# EAGLE design vending-machine-v2-arduino-shield-r2 (EAGLE 5.11)
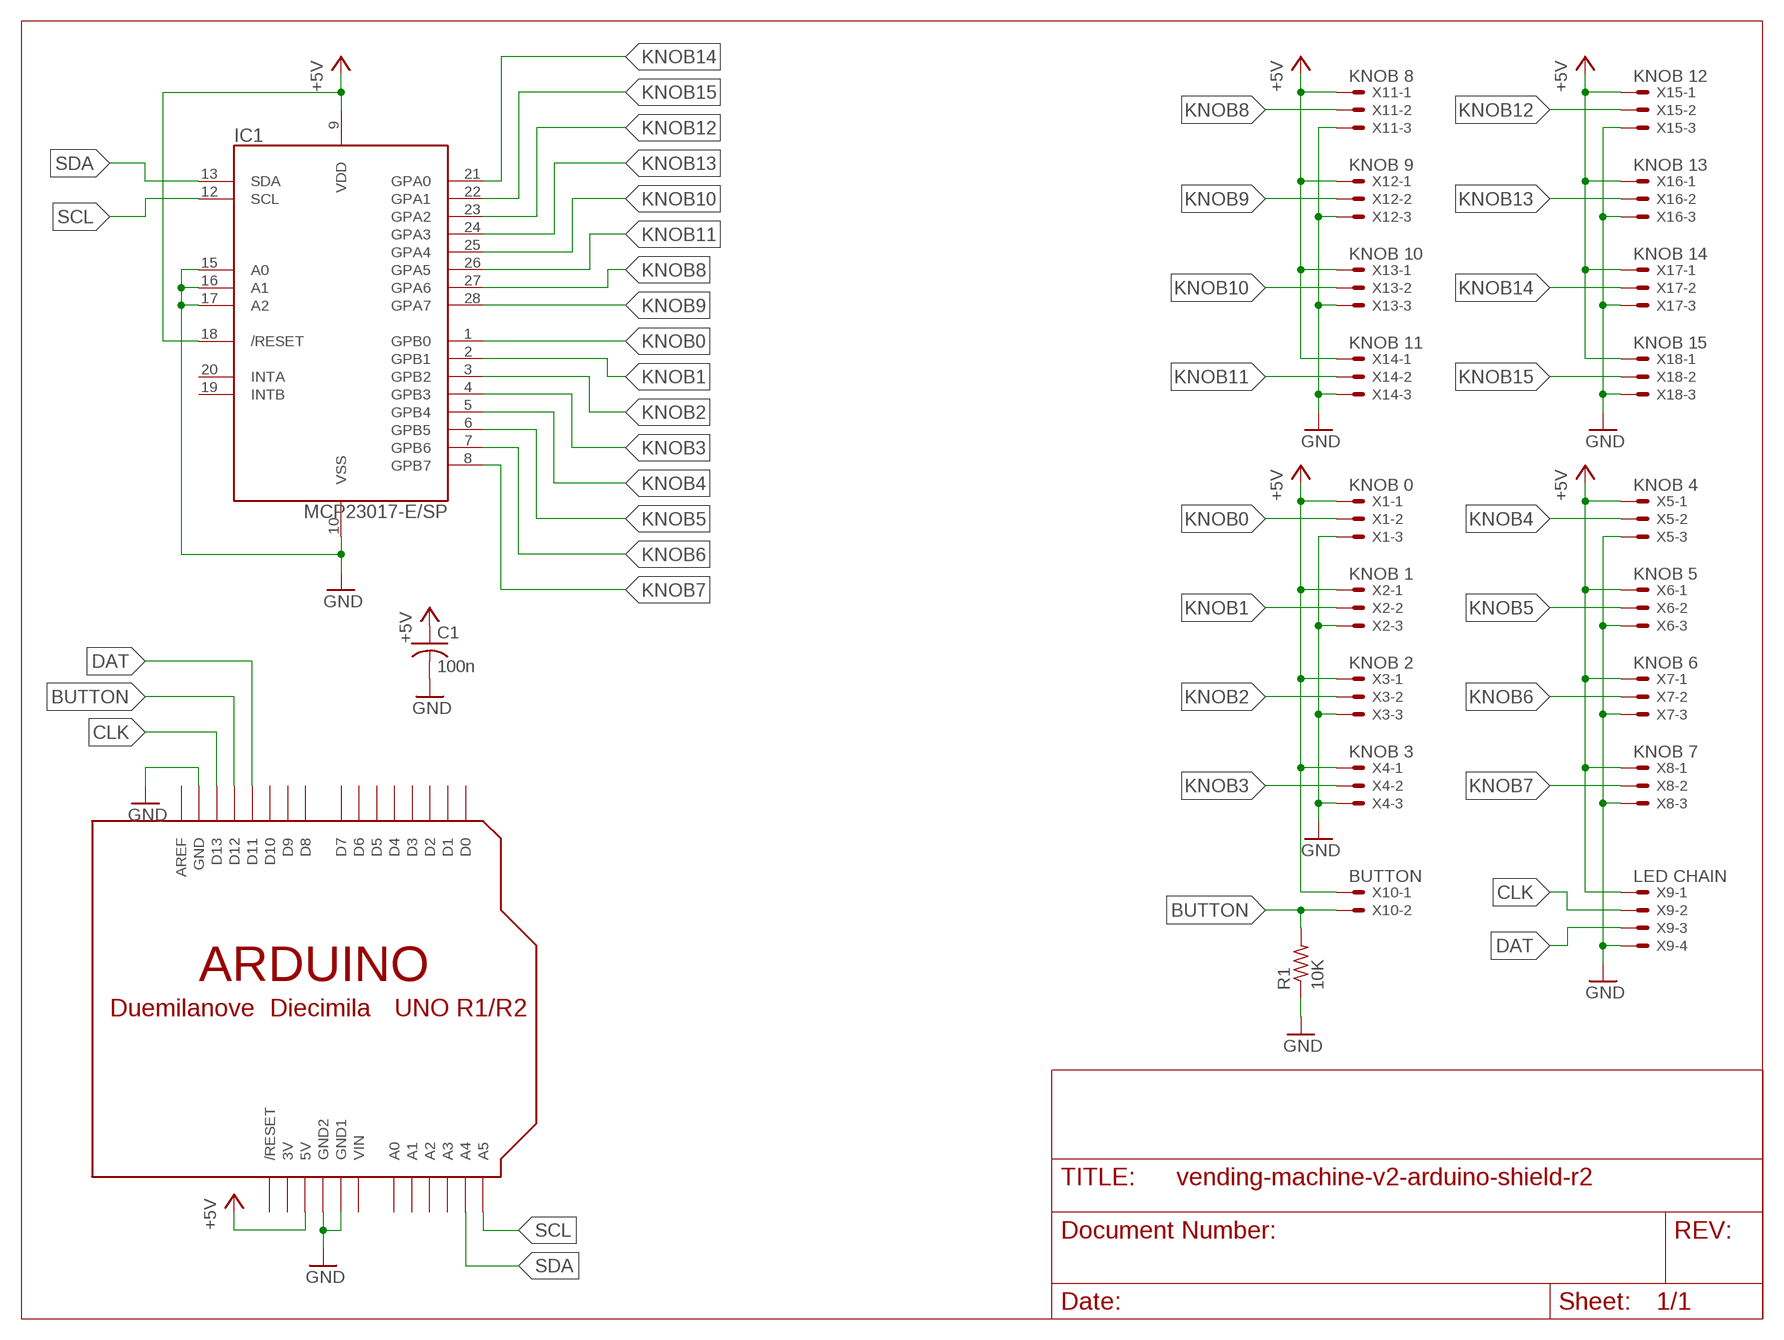
[diagram p0: schematic, sheet 1]

## Parts
C1  100n  C-US025-025X050  [C025-025X050]
IC1  MCP23017-E/SP  [DIP-28S]
R1  10K  R-US_0204/2V  [0204V]
U$1  ARDUINOUNO  [ARDUINO]
X1  KNOB 0  22-23-2031  [22-23-2031]
X2  KNOB 1  22-23-2031  [22-23-2031]
X3  KNOB 2  22-23-2031  [22-23-2031]
X4  KNOB 3  22-23-2031  [22-23-2031]
X5  KNOB 4  22-23-2031  [22-23-2031]
X6  KNOB 5  22-23-2031  [22-23-2031]
X7  KNOB 6  22-23-2031  [22-23-2031]
X8  KNOB 7  22-23-2031  [22-23-2031]
X9  LED CHAIN  22-23-2041  [22-23-2041]
X10  BUTTON  22-23-2021  [22-23-2021]
X11  KNOB 8  22-23-2031  [22-23-2031]
X12  KNOB 9  22-23-2031  [22-23-2031]
X13  KNOB 10  22-23-2031  [22-23-2031]
X14  KNOB 11  22-23-2031  [22-23-2031]
X15  KNOB 12  22-23-2031  [22-23-2031]
X16  KNOB 13  22-23-2031  [22-23-2031]
X17  KNOB 14  22-23-2031  [22-23-2031]
X18  KNOB 15  22-23-2031  [22-23-2031]

## Nets
+5V: C1.1 IC1.9(VDD) IC1.18(/RESET) U$1.5V X1.1 X2.1 X3.1 X4.1 X5.1 X6.1 X7.1 X8.1 X9.1 X10.1 X11.1 X12.1 X13.1 X14.1 X15.1 X16.1 X17.1 X18.1
BUTTON: R1.2 U$1.D12 X10.2
CLK: U$1.D13 X9.2
DAT: U$1.D11 X9.3
GND: C1.2 IC1.10(VSS) IC1.15(A0) IC1.16(A1) IC1.17(A2) R1.1 U$1.GND U$1.GND1 U$1.GND2 X1.3 X2.3 X3.3 X4.3 X5.3 X6.3 X7.3 X8.3 X9.4 X11.3 X12.3 X13.3 X14.3 X15.3 X16.3 X17.3 X18.3
KNOB0: IC1.1(GPB0) X1.2
KNOB1: IC1.2(GPB1) X2.2
KNOB2: IC1.3(GPB2) X3.2
KNOB3: IC1.4(GPB3) X4.2
KNOB4: IC1.5(GPB4) X5.2
KNOB5: IC1.6(GPB5) X6.2
KNOB6: IC1.7(GPB6) X7.2
KNOB7: IC1.8(GPB7) X8.2
KNOB8: IC1.27(GPA6) X11.2
KNOB9: IC1.28(GPA7) X12.2
KNOB10: IC1.25(GPA4) X13.2
KNOB11: IC1.26(GPA5) X14.2
KNOB12: IC1.23(GPA2) X15.2
KNOB13: IC1.24(GPA3) X16.2
KNOB14: IC1.21(GPA0) X17.2
KNOB15: IC1.22(GPA1) X18.2
SCL: IC1.12(SCL) U$1.A5
SDA: IC1.13(SDA) U$1.A4
Unconnected: IC1.19(INTB) IC1.20(INTA) U$1.A0 U$1.A1 U$1.A2 U$1.A3 U$1.AREF U$1.D0 U$1.D1 U$1.D2 U$1.D3 U$1.D4 U$1.D5 U$1.D6 U$1.D7 U$1.D8 U$1.D9 U$1.D10 U$1.RESET(/RESET)

## Power pins joined to a net without a drawn wire
3V: U$1.3V
VIN: U$1.VIN

## Library data of the parts
C1 = rcl:C-US: CAPACITOR, American symbol
IC1 = rbg-microchip-ioexpander:MCP23017
R1 = rcl:R-US_: RESISTOR, American symbol
U$1 = adafruit:ARDUINO: Arduino Diecimila/Duemilanove Make a shield with ease, this package has all the named pins as well as the two mounting drill holes and an outline of the USB and DC power connector. The outline is on the DIMENSION layer, so if your board house uses it they will cut the outline to match. http://www.ladyada.net/library/pcb/eaglelibrary.html
X1-X8 X11-X18 = con-molex:22-23-2031: .100" (2.54mm) Center Header - 3 Pin; MF: MOLEX; MPN: 22-23-2031; OC_FARNELL: 1462950; OC_NEWARK: 30C0862
X9 = con-molex:22-23-2041: .100" (2.54mm) Center Header - 4 Pin; MF: MOLEX; MPN: 22-23-2041; OC_FARNELL: 1462920; OC_NEWARK: 38C0355
X10 = con-molex:22-23-2021: .100" (2.54mm) Center Header - 2 Pin; MF: MOLEX; MPN: 22-23-2021; OC_FARNELL: 1462926; OC_NEWARK: 25C3832

## Board
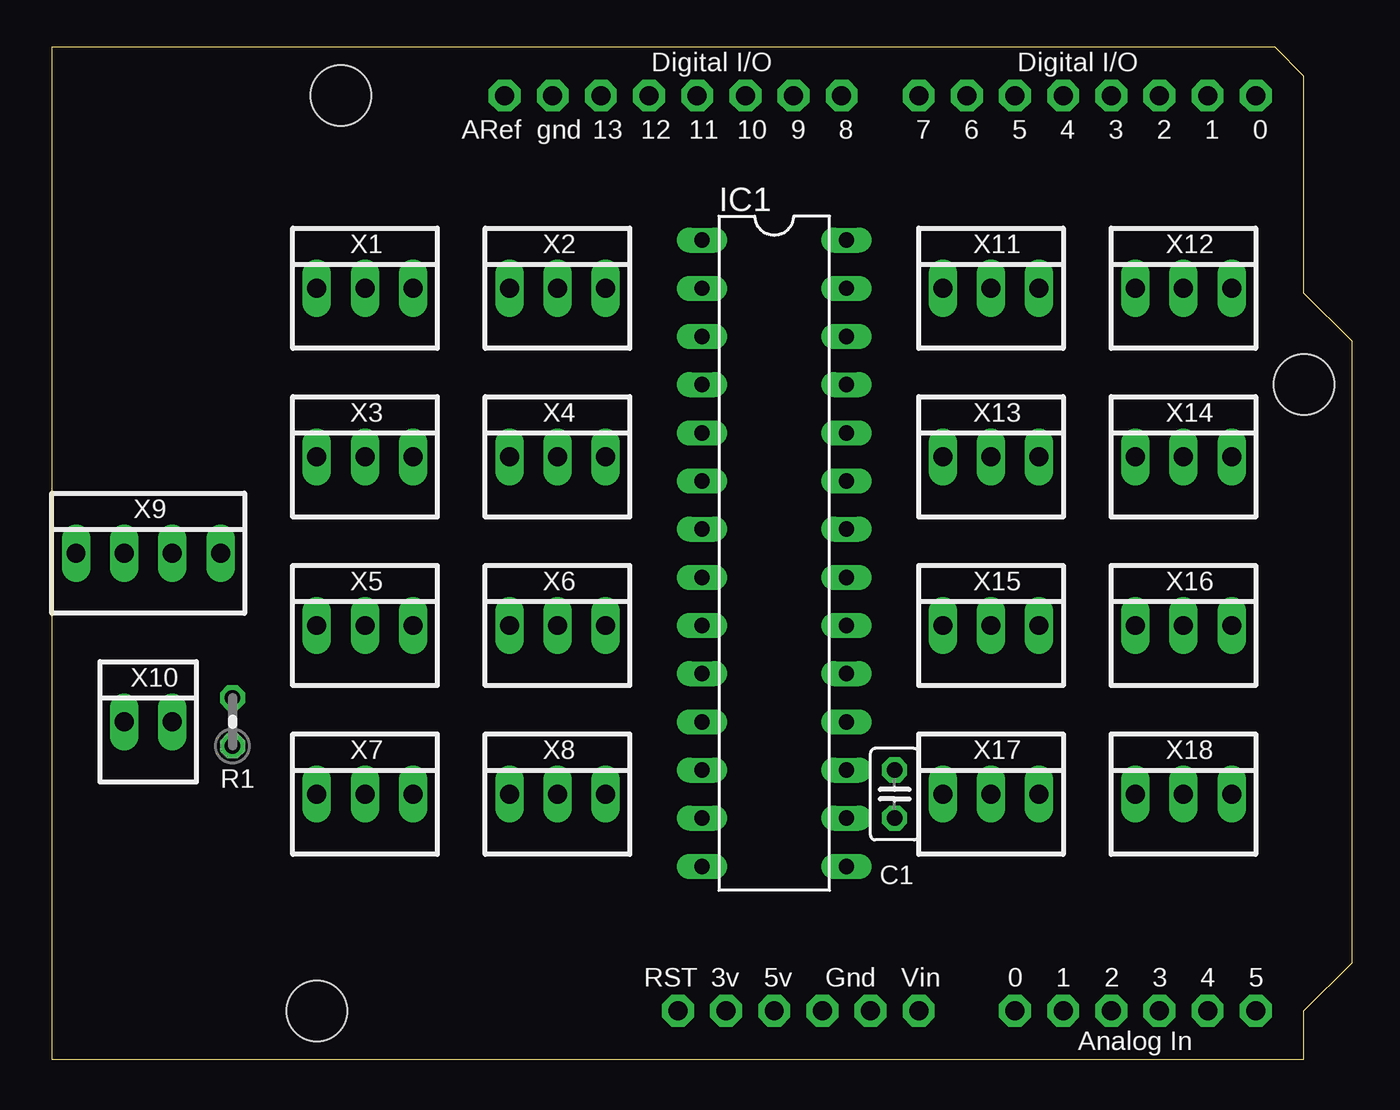
[diagram p1: board, top side]
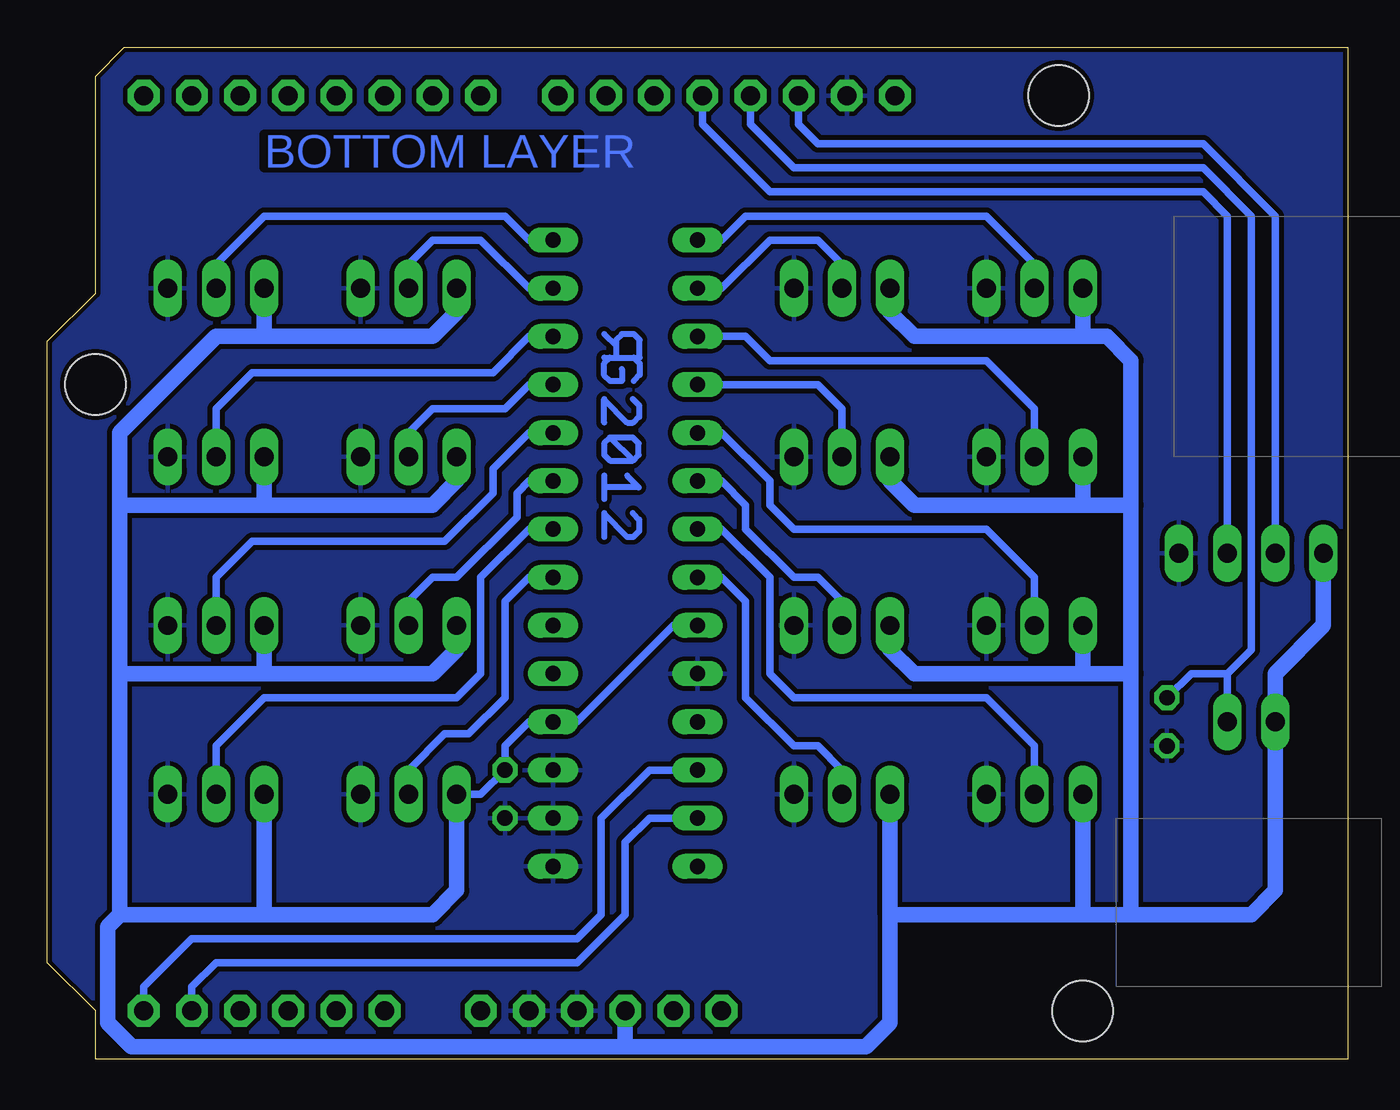
[diagram p2: board, bottom side, seen from below]

Size 68.58 x 53.34 mm. Coordinates in mm from the lower left corner, seen from the top.
Copper layers (1*16): Top 0.035mm / dielectric 1.5mm / Bottom 0.035mm
Design rules "default *": minimum track width 10mil, minimum drill 24mil, track to track 8mil, track to pad 8mil, pad to pad 8mil, via to via 8mil, smd to smd 8mil, copper to edge 10mil, drill to drill 8mil, minimum pad ring 10mil, minimum via ring 8mil, stop-mask expansion 4mil, vias tented up to drill 0mil, thermal gap 10mil

### Footprints (pad centres in the part's own frame; a part is rotated, then mirrored left to right if it is on the bottom)
C025-025X050 = drill 0.813 octagon: 1 -1.27,0; 2 1.27,0
DIP-28S = drill 0.813 long: 1 -16.51,-3.81; 2 -13.97,-3.81; 3 -11.43,-3.81; 4 -8.89,-3.81; 5 -6.35,-3.81; 6 -3.81,-3.81; 7 -1.27,-3.81; 8 1.27,-3.81; 9 3.81,-3.81; 10 6.35,-3.81; 11 8.89,-3.81; 12 11.43,-3.81; 13 13.97,-3.81; 14 16.51,-3.81; 15 16.51,3.81; 16 13.97,3.81; 17 11.43,3.81; 18 8.89,3.81; 19 6.35,3.81; 20 3.81,3.81; 21 1.27,3.81; 22 -1.27,3.81; 23 -3.81,3.81; 24 -6.35,3.81; 25 -8.89,3.81; 26 -11.43,3.81; 27 -13.97,3.81; 28 -16.51,3.81
0204V = drill 0.813 octagon: 1 -1.27,0; 2 1.27,0
ARDUINO = drill 1 pad 1.676 octagon: 3V 35.56,2.54; 5V 38.1,2.54; A0 50.8,2.54; A1 53.34,2.54; A2 55.88,2.54; A3 58.42,2.54; A4 60.96,2.54; A5 63.5,2.54; AREF 23.876,50.8; D0 63.5,50.8; D1 60.96,50.8; D2 58.42,50.8; D3 55.88,50.8; D4 53.34,50.8; D5 50.8,50.8; D6 48.26,50.8; D7 45.72,50.8; D8 41.656,50.8; D9 39.116,50.8; D10 36.576,50.8; D11 34.036,50.8; D12 31.496,50.8; D13 28.956,50.8; GND 26.416,50.8; GND1 43.18,2.54; GND2 40.64,2.54; RESET 33.02,2.54; VIN 45.72,2.54 | hole 3.2: 15.24,50.8; 66.04,35.56; 13.97,2.54
22-23-2031 = drill 1 long: 1 -2.54,0; 2 0,0; 3 2.54,0
22-23-2041 = drill 1 long: 1 -3.81,0; 2 -1.27,0; 3 1.27,0; 4 3.81,0
22-23-2021 = drill 1 long: 1 -1.27,0; 2 1.27,0

### Placement (x,y rotation side)
C1  44.45,13.97 270 top
IC1  38.1,26.67 270 top
R1  9.53,17.78 90 top
U$1  0,0 0 top
U$2  [RGLOGO_SMALL_2012]  39.37,36.83 270 bottom
X1  16.51,40.64 0 top
X2  26.67,40.64 0 top
X3  16.51,31.75 0 top
X4  26.67,31.75 0 top
X5  16.51,22.86 0 top
X6  26.67,22.86 0 top
X7  16.51,13.97 0 top
X8  26.67,13.97 0 top
X9  5.08,26.67 0 top
X10  5.08,17.78 0 top
X11  49.53,40.64 0 top
X12  59.69,40.64 0 top
X13  49.53,31.75 0 top
X14  59.69,31.75 0 top
X15  49.53,22.86 0 top
X16  59.69,22.86 0 top
X17  49.53,13.97 0 top
X18  59.69,13.97 0 top

### Tracks (layer width: path | path; a pad name or v marks a point on that pad's centre or on a via)
+5V
  Bottom 0.406: IC1.9 35.56,22.86 40.64,17.78 IC1.18 43.18,17.78 44.45,16.51 C1.1 45.72,13.97 X17.1
  Bottom 0.813: X2.1 24.13,39.37 22.86,38.1 13.97,38.1 | 13.97,38.1 12.7,38.1 11.43,36.83 11.43,29.21 | 11.43,20.32 11.43,29.21 | 11.43,7.62 11.43,20.32 | 11.43,7.62 13.97,7.62 | 13.97,7.62 24.13,7.62 | 24.13,7.62 X8.1 | 13.97,7.62 X7.1 | X6.1 24.13,21.59 22.86,20.32 13.97,20.32 | 11.43,20.32 13.97,20.32 | 13.97,20.32 X5.1 | X4.1 24.13,30.48 22.86,29.21 13.97,29.21 | 11.43,29.21 13.97,29.21 | 13.97,29.21 X3.1 | 13.97,38.1 X1.1 | X11.1 46.99,39.37 48.26,38.1 57.15,38.1 | 57.15,38.1 59.69,38.1 64.77,33.02 64.77,29.21 | 64.77,20.32 64.77,29.21 | 64.77,7.62 64.77,20.32 | 64.77,7.62 57.15,7.62 | 57.15,7.62 X18.1 | X15.1 46.99,21.59 48.26,20.32 57.15,20.32 | 64.77,20.32 57.15,20.32 | 57.15,20.32 X16.1 | X13.1 46.99,30.48 48.26,29.21 57.15,29.21 | 64.77,29.21 57.15,29.21 | 57.15,29.21 X14.1 | 57.15,38.1 X12.1 | 24.13,7.62 24.13,1.91 25.4,0.64 38.1,0.64 | 38.1,0.64 64.14,0.64 65.41,1.91 65.41,6.99 64.77,7.62 | X17.1 46.99,8.89 48.26,7.62 57.15,7.62 | 38.1,0.64 U$1.5V | X9.1 1.27,22.86 3.81,20.32 X10.1 3.81,8.89 5.08,7.62 11.43,7.62
BUTTON
  Bottom 0.406: U$1.D12 31.5,49.28 29.21,46.99 7.62,46.99 5.08,44.45 5.08,21.59 6.35,20.32 | X10.2 6.35,20.32 | 6.35,20.32 8.26,20.32 R1.2
CLK
  Bottom 0.406: U$1.D13 28.96,49.28 27.94,48.26 7.62,48.26 3.81,44.45 X9.2
DAT
  Bottom 0.406: U$1.D11 34.04,49.28 30.48,45.72 7.62,45.72 6.35,44.45 X9.3
GND
  pour Bottom (isolate 0.254): -1.27,54.61 69.85,54.61 69.85,-1.27 -1.27,-1.27
KNOB0
  Bottom 0.406: IC1.1 33.02,43.18 31.75,44.45 19.05,44.45 16.51,41.91 X1.2
KNOB1
  Bottom 0.406: IC1.2 33.02,40.64 30.48,43.18 27.94,43.18 26.67,41.91 X2.2
KNOB2
  Bottom 0.406: IC1.3 31.75,38.1 30.48,36.83 19.05,36.83 16.51,34.29 X3.2
KNOB3
  Bottom 0.406: IC1.4 27.94,35.56 26.67,34.29 X4.2
KNOB4
  Bottom 0.406: IC1.5 33.02,33.02 30.48,30.48 30.48,29.21 29.21,27.94 19.05,27.94 16.51,25.4 X5.2
KNOB5
  Bottom 0.406: IC1.6 33.02,30.48 31.75,29.21 31.75,27.94 29.21,25.4 27.94,25.4 26.67,24.13 X6.2
KNOB6
  Bottom 0.406: IC1.7 33.02,27.94 30.48,25.4 30.48,20.32 29.21,19.05 19.05,19.05 16.51,16.51 X7.2
KNOB7
  Bottom 0.406: IC1.8 33.02,25.4 31.75,24.13 31.75,19.05 29.21,16.51 27.94,16.51 26.67,15.24 X8.2
KNOB8
  Bottom 0.406: IC1.27 43.18,40.64 45.72,43.18 48.26,43.18 49.53,41.91 X11.2
KNOB9
  Bottom 0.406: IC1.28 43.18,43.18 44.45,44.45 57.15,44.45 59.69,41.91 X12.2
KNOB10
  Bottom 0.406: X13.2 49.53,33.02 48.26,34.29 44.45,34.29 43.18,35.56 IC1.25
KNOB11
  Bottom 0.406: X14.2 59.69,34.29 57.78,36.2 45.09,36.2 43.18,38.1 IC1.26
KNOB12
  Bottom 0.406: IC1.23 43.18,30.48 43.81,29.84 43.81,28.57 46.99,25.4 48.26,25.4 49.53,24.13 X15.2
KNOB13
  Bottom 0.406: IC1.24 43.18,33.02 45.09,31.11 45.09,29.84 47.62,27.3 57.78,27.3 59.69,25.4 X16.2
KNOB14
  Bottom 0.406: IC1.21 43.18,25.4 44.45,24.13 44.45,19.05 46.35,17.14 47.62,17.14 49.53,15.24 X17.2
KNOB15
  Bottom 0.406: IC1.22 43.18,27.94 45.72,25.4 45.72,20.32 46.99,19.05 57.15,19.05 59.69,16.51 X18.2
SCL
  Bottom 0.406: U$1.A5 63.5,3.81 60.96,6.35 40.64,6.35 39.37,7.62 39.37,12.7 36.83,15.24 IC1.12
SDA
  Bottom 0.406: IC1.13 36.83,12.7 38.1,11.43 38.1,7.62 40.64,5.08 59.69,5.08 60.96,3.81 U$1.A4

### Text on the board
Bottom: BOTTOM LAYER